# EAGLE design keypad (EAGLE 6.5.0)

## Sheet 1 of 2
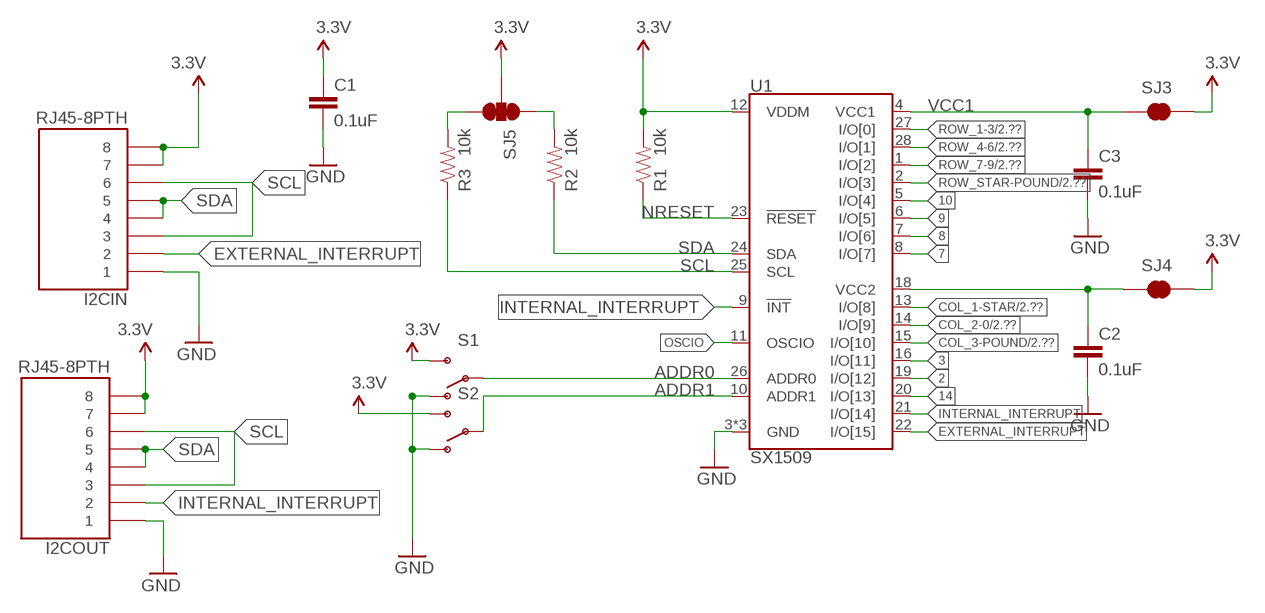
[diagram p0: schematic, sheet 1]

### Parts
C1  0.1uF  CAP0402-CAP  [0402-CAP]
C2  0.1uF  CAP0402-CAP  [0402-CAP]
C3  0.1uF  CAP0402-CAP  [0402-CAP]
I2CIN  RJ45-8PTH  [RJ45-8]
I2COUT  RJ45-8PTH  [RJ45-8]
R1  10k  RESISTOR0402-RES  [0402-RES]
R2  10k  RESISTOR0402-RES  [0402-RES]
R3  10k  RESISTOR0402-RES  [0402-RES]
S1  SWITCH-SPDT-SMD-A  [SWITCH-SPST-SMD-A]
S2  SWITCH-SPDT-SMD-A  [SWITCH-SPST-SMD-A]
SJ3  SOLDERJUMPERNO  [SJ_2S-NO]
SJ4  SOLDERJUMPERNO  [SJ_2S-NO]
SJ5  SOLDERJUMPER_2WAYS  [SJ_3]
U1  SX1509  [QFN-28]

### Nets
2: U1.19(I/O[12])
3: U1.16(I/O[11])
3.3V: C1.1 I2CIN.7 I2CIN.8 I2COUT.7 I2COUT.8 R1.2 S1.3(S) S2.3(S) SJ3.2 SJ4.2 SJ5.2 U1.12(VDDM)
7: U1.8(I/O[7])
8: U1.7(I/O[6])
9: U1.6(I/O[5])
10: U1.5(I/O[4])
14: U1.20(I/O[13])
ADDR0: S1.2(P) U1.26(ADDR0)
ADDR1: S2.2(P) U1.10(ADDR1)
COL_1-STAR: U1.13(I/O[8]) ; also sheet 2
COL_2-0: U1.14(I/O[9]) ; also sheet 2
COL_3-POUND: U1.15(I/O[10]) ; also sheet 2
EXTERNAL_INTERRUPT: I2CIN.2 U1.22(I/O[15])
GND: C1.2 C2.2 C3.2 I2CIN.1 I2COUT.1 S1.1(O) S2.1(O) U1.3(GND) U1.17(GND) U1.29(GND)
INTERNAL_INTERRUPT: I2COUT.2 U1.9(!INT) U1.21(I/O[14])
N$1: R3.2 SJ5.3
N$2: R2.2 SJ5.1
NRESET: R1.1 U1.23(!RESET)
OSCIO: U1.11(OSCIO)
ROW_1-3: U1.27(I/O[0]) ; also sheet 2
ROW_4-6: U1.28(I/O[1]) ; also sheet 2
ROW_7-9: U1.1(I/O[2]) ; also sheet 2
ROW_STAR-POUND: U1.2(I/O[3]) ; also sheet 2
SCL: I2CIN.3 I2CIN.6 I2COUT.3 I2COUT.6 R3.1 U1.25(SCL)
SDA: I2CIN.4 I2CIN.5 I2COUT.4 I2COUT.5 R2.1 U1.24(SDA)
VCC1: C3.1 SJ3.1 U1.4(VCC1)
VCC2: C2.1 SJ4.1 U1.18(VCC2)

## Sheet 2 of 2
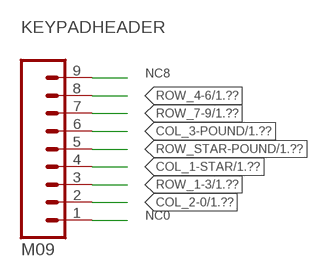
[diagram p1: schematic, sheet 2]

### Parts
KEYPADHEADER  M09  [1X09]

### Nets
COL_1-STAR: KEYPADHEADER.4 ; also sheet 1
COL_2-0: KEYPADHEADER.2 ; also sheet 1
COL_3-POUND: KEYPADHEADER.6 ; also sheet 1
NC0: KEYPADHEADER.1
NC8: KEYPADHEADER.9
ROW_1-3: KEYPADHEADER.3 ; also sheet 1
ROW_4-6: KEYPADHEADER.8 ; also sheet 1
ROW_7-9: KEYPADHEADER.7 ; also sheet 1
ROW_STAR-POUND: KEYPADHEADER.5 ; also sheet 1

## Library data of the parts
C1-C3 = SparkFun-Passives:CAP: Capacitor Standard 0603 ceramic capacitor, and 0.1" leaded capacitor.
I2CIN I2COUT = SparkFun-Connectors:RJ45-8: RJ45 Jack Simple RJ45, 8-pin connection - connector for common Cat5, Cat5e, and Cat6 Ethernet cables. Footprint not yet proven in production. Connector sku is PRT-00643; Breakout PCB sku is BOB-00716.
KEYPADHEADER = SparkFun-Connectors:M09: Header 9 Standard 9-pin 0.1" header. Use with straight break away headers (SKU : PRT-00116), right angle break away headers (PRT-00553), swiss pins (PRT-00743), machine pins (PRT-00117), and female headers (PRT-00115).
R1-R3 = SparkFun-Passives:RESISTOR: Resistor Basic schematic elements and footprints for 0603, 1206, and PTH resistors.
S1 S2 = SparkFun-Electromechanical:SWITCH-SPDT: SPDT Switch Simple slide switch, Spark Fun Electronics SKU : COM-00102 DPDT SMT slide switch, AYZ0202, SWCH-08179
SJ3 SJ4 = SparkFun-Passives:SOLDERJUMPER: Solder Jumper Standard SMD solder jumper. Used to automate production. Two varients : Normally Open and Normally Closed are the same, but have different paste layers. NC will have a large amount of paste and should jumper during reflow.
SJ5 = SparkFun-Passives:SOLDERJUMPER_2WAY: Solder Jumper 2 way solder jumper
U1 = SparkFun-DigitalIC:SX1509

## Board
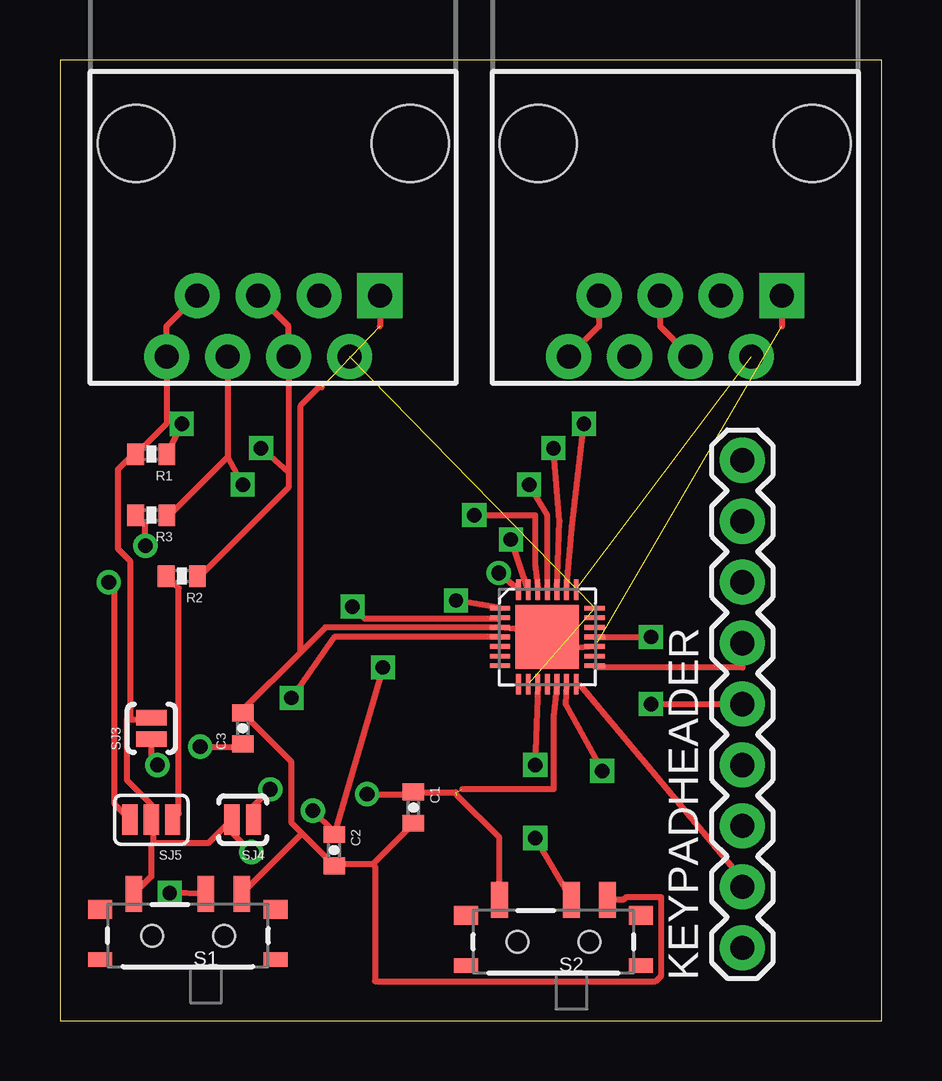
[diagram p2: board, top side]
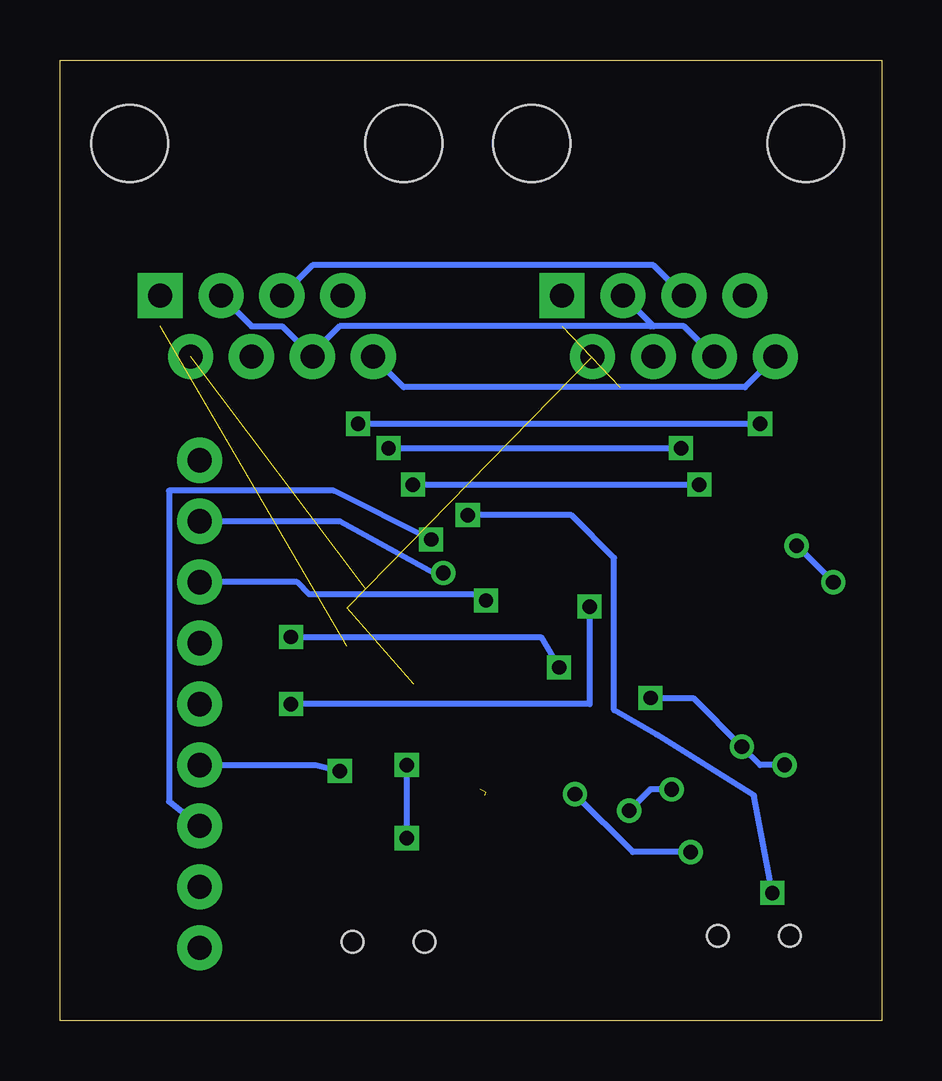
[diagram p3: board, bottom side, seen from below]

Size 34.27 x 40.06 mm. Coordinates in mm from the lower left corner, seen from the top.
Outline: 0,0 34.27,0 34.27,40.06 0,40.06 0,0
Copper layers (1*16): Top 0.035mm / dielectric 1.5mm / Bottom 0.035mm
Design rules "default": minimum track width 10mil, minimum drill 24mil, track to track 8mil, track to pad 8mil, pad to pad 8mil, via to via 8mil, smd to smd 8mil, copper to edge 40mil, drill to drill 8mil, minimum pad ring 10mil, minimum via ring 8mil, stop-mask expansion 4mil, vias tented up to drill 0mil, thermal gap 10mil

### Footprints (pad centres in the part's own frame; a part is rotated, then mirrored left to right if it is on the bottom)
0402-CAP = smd 0.7 x 0.9: 1 -0.65,0; 2 0.65,0
RJ45-8 = drill 1 pad 1.88 square: 1 -4.445,6.35 | drill 1 pad 1.88: 2 -3.175,8.89; 3 -1.905,6.35; 4 -0.635,8.89; 5 0.635,6.35; 6 1.905,8.89; 7 3.175,6.35; 8 4.445,8.89 | hole 3.2: -5.715,0; 5.715,0
1X09 = drill 1.016 pad 1.88: 1 0,0; 2 2.54,0; 3 5.08,0; 4 7.62,0; 5 10.16,0; 6 12.7,0; 7 15.24,0; 8 17.78,0; 9 20.32,0
0402-RES = smd 0.7 x 0.9: 1 -0.65,0; 2 0.65,0
SWITCH-SPST-SMD-A = smd 0.7 x 1.5: 1 -2.25,-1.75; 2 -0.75,-1.75; 3 2.25,-1.75 | smd 1 x 0.6: GND1 -3.65,1; GND3 3.65,1 | smd 1 x 0.8: GND2 -3.65,-1.1; GND4 3.65,-1.1 | hole 0.9: -1.5,0; 1.5,0
SJ_2S-NO = smd 0.635 x 1.27: 1 -0.45,0; 2 0.45,0
SJ_3 = smd 0.635 x 1.27: 1 -0.889,0; 2 0,0; 3 0.889,0
QFN-28 = smd 0.85 x 0.2: 1 -1.975,1.2; 2 -1.975,0.8; 3 -1.975,0.4; 4 -1.975,0; 5 -1.975,-0.4; 6 -1.975,-0.8; 7 -1.975,-1.2; 15 1.975,-1.2; 16 1.975,-0.8; 17 1.975,-0.4; 18 1.975,0; 19 1.975,0.4; 20 1.975,0.8; 21 1.975,1.2 | smd 0.2 x 0.85: 8 -1.2,-1.975; 9 -0.8,-1.975; 10 -0.4,-1.975; 11 0,-1.975; 12 0.4,-1.975; 13 0.8,-1.975; 14 1.2,-1.975; 22 1.2,1.975; 23 0.8,1.975; 24 0.4,1.975; 25 0,1.975; 26 -0.4,1.975; 27 -0.8,1.975; 28 -1.2,1.975 | smd 2.65 x 2.65: 29 0,0

### Placement (x,y rotation side)
C1  14.73,8.89 270 top
C2  11.43,7.11 270 top
C3  7.62,12.19 90 top
I2CIN  25.65,36.58 180 top
I2COUT  8.89,36.58 180 top
KEYPADHEADER  28.45,3.05 90 top
R1  3.81,23.62 180 top
R2  5.08,18.54 180 top
R3  3.81,21.08 180 top
S1  5.33,3.56 180 top
S2  20.57,3.3 180 top
SJ3  3.81,12.19 90 top
SJ4  7.62,8.38 180 top
SJ5  3.81,8.38 180 top
U1  20.32,16 0 top

### Tracks (layer width: path | path; a pad name or v marks a point on that pad's centre or on a via)
3.3V  (via drill 0.61)  (2 unrouted)
  Top 0.254: 2.92,12.57 2.79,12.57 2.79,10.03 3.81,9.02 SJ5.2 3.89,8.28 3.89,7.42 | 2.92,12.57 3.81,12.57 SJ3.2 | I2CIN.8 22.48,28.96 I2CIN.7 | I2COUT.7 4.45,28.96 I2COUT.8 4.45,24.89 3.17,23.62 R1.2 3.05,23.62 2.41,22.99 2.41,19.68 2.92,19.18 2.92,12.57 | 3.89,7.42 6.2,7.42 SJ4.2 6.99,8.03 v7.98,7.04 | S1.3 3.1,5.31 3.81,6.02 3.81,7.31 3.89,7.42 | v12.8,9.45 14.63,9.45 C1.1 14.83,9.52 16.51,9.52 | 16.56,9.4 18.31,7.64 S2.3 | U1.12 20.57,12.7 20.57,9.65 16.76,9.65
  Bottom 0.254: I2CIN.8 19.94,26.42 5.71,26.42 I2COUT.8 | v12.8,9.45 10.39,7.04 v7.98,7.04
ADDR0  (via drill 0.6)
  Top 0.254: S1.2 v4.57,5.33 | v17.27,21.08 19.81,21.08 19.81,19.05 U1.26
  Bottom 0.254: v4.57,5.33 5.33,9.4 9.4,11.94 11.18,12.95 11.18,19.3 12.95,21.08 v17.27,21.08
ADDR1  (via drill 0.6)
  Top 0.254: U1.10 v19.81,10.67 | v19.81,7.62 S2.2
  Bottom 0.254: v19.81,10.67 v19.81,7.62
COL_1-STAR  (via drill 0.6)
  Top 0.254: U1.13 21.08,13.21 v22.61,10.41
  Bottom 0.254: v22.61,10.41 23.62,10.67 KEYPADHEADER.4
COL_2-0
  Top 0.254: U1.14 21.59,13.97 21.72,13.97 28.07,6.35 KEYPADHEADER.2
COL_3-POUND
  Top 0.254: KEYPADHEADER.6 28.45,14.73 22.35,14.73 U1.15
EXTERNAL_INTERRUPT  (1 unrouted)
GND  (2 unrouted)
  Top 0.254: I2CIN.1 30.1,28.96 | I2COUT.1 13.34,28.96 | 10.1,7.81 11.43,6.48 C2.2 11.53,6.55 13.06,6.55 | 10.1,7.81 9.65,8.25 9.65,10.79 7.62,12.83 C3.2 7.62,12.95 10.03,15.37 | 10.03,15.37 10.03,25.65 10.86,26.48 10.92,26.42 | 10.03,15.37 11.07,16.4 U1.3 19.81,16.26 U1.29 21.08,15.49 U1.17 | 10.1,7.81 7.59,5.31 S1.1 | 13.06,6.55 14.73,8.23 C1.2 | S2.1 22.84,5.05 23.5,5.05 23.6,5.16 25.07,5.16 25.07,1.88 24.84,1.65 13.13,1.65 13.13,6.45 13.06,6.55
INTERNAL_INTERRUPT  (2 unrouted)
N$1  (via drill 0.61)
  Top 0.254: v3.56,19.81 3.56,20.7 3.17,21.08 R3.2 | v2.03,18.29 2.29,18.03 2.29,9.02 SJ5.3
  Bottom 0.254: v2.03,18.29 v3.56,19.81
N$2
  Top 0.254: SJ5.1 4.95,8.64 4.95,18.03 4.45,18.54 R2.2
NRESET  (via drill 0.6)
  Top 0.254: R1.1 v5.08,24.89 | U1.23 21.34,20.57 v21.84,24.89
  Bottom 0.254: v21.84,24.89 v5.08,24.89
ROW_1-3  (via drill 0.6)
  Top 0.254: U1.27 v18.8,20.07
  Bottom 0.254: v18.8,20.07 22.86,22.1 29.72,22.1 29.72,9.14 KEYPADHEADER.3
ROW_4-6  (via drill 0.61)
  Top 0.254: U1.28 v18.29,18.67
  Bottom 0.254: 18.67,18.54 v18.29,18.67 18.67,18.67 22.61,20.83 KEYPADHEADER.8
ROW_7-9  (via drill 0.6)
  Top 0.254: U1.1 v16.51,17.53
  Bottom 0.254: v16.51,17.53 16.76,17.78 23.88,17.78 24.38,18.29 KEYPADHEADER.7
ROW_STAR-POUND  (via drill 0.6)
  Top 0.254: U1.2 18.29,16.76 12.7,16.76 v12.19,17.27 | v24.64,13.21 KEYPADHEADER.5
  Bottom 0.254: v12.19,17.27 12.19,13.21 v24.64,13.21
SCL  (via drill 0.6)
  Top 0.254: 6.99,23.49 4.57,21.08 R3.1 | I2COUT.6 6.99,23.49 | 6.99,23.49 v7.62,22.35 | U1.25 20.32,21.08 v19.56,22.35
  Bottom 0.254: I2CIN.3 26.29,28.96 25.02,28.96 I2CIN.6 23.75,27.81 22.61,28.96 9.65,28.96 9.59,29.02 | 9.59,29.02 9.53,28.96 8.26,28.96 I2COUT.6 | 9.59,29.02 I2COUT.3 | v19.56,22.35 v7.62,22.35
SDA  (via drill 0.6)
  Top 0.254: I2CIN.4 25.02,28.96 I2CIN.5 | 9.53,22.86 I2COUT.4 9.53,28.96 I2COUT.5 | 9.53,22.86 9.53,22.23 5.84,18.54 R2.1 | U1.24 20.83,20.83 v20.57,23.88 | v8.38,23.88 9.53,22.86
  Bottom 0.254: I2CIN.5 23.75,31.5 9.53,31.5 I2COUT.5 | v20.57,23.88 v8.38,23.88
VCC1  (via drill 0.6, 0.61)
  Top 0.254: v5.84,11.43 7.62,11.43 C3.1 | v4.06,10.67 3.81,10.92 SJ3.1 | U1.4 11.43,16 v9.65,13.46
  Bottom 0.254: v4.06,10.67 5.08,10.67 v5.84,11.43 7.87,13.46 v9.65,13.46
VCC2  (via drill 0.6, 0.61)
  Top 0.254: v10.54,8.76 11.43,7.87 C2.1 v13.46,14.73 | v8.76,9.65 8,8.89 8,8.38 SJ4.1 | U1.18 v24.64,16
  Bottom 0.254: v10.54,8.76 9.65,9.65 v8.76,9.65 | v24.64,16 14.22,16 v13.46,14.73